# Altium schematic sheet DB_TPM.SchDoc
size Letter
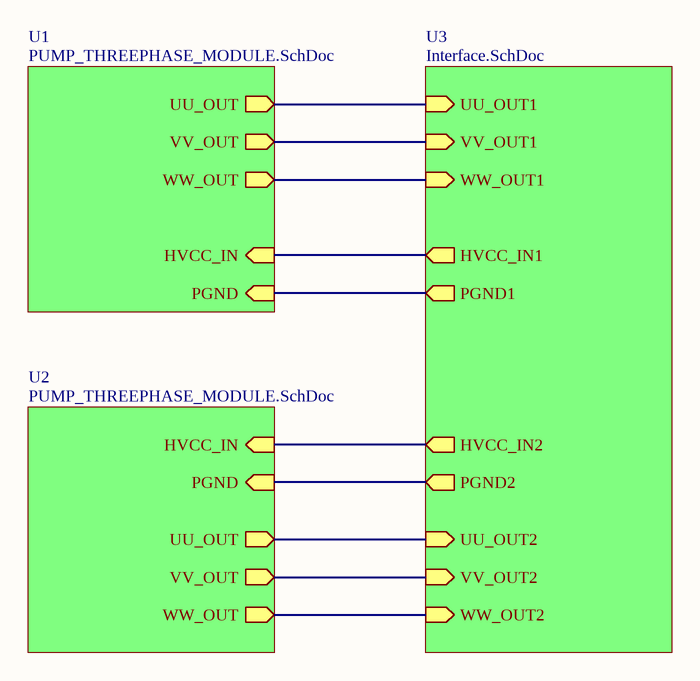
[diagram p0: DB_TPM.SchDoc]

## Sub-sheets
U1 = PUMP_THREEPHASE_MODULE.SchDoc: WW_OUT (out), VV_OUT (out), UU_OUT (out), HVCC_IN (in), PGND (in)
U2 = PUMP_THREEPHASE_MODULE.SchDoc: WW_OUT (out), VV_OUT (out), UU_OUT (out), HVCC_IN (in), PGND (in)
U3 = Interface.SchDoc: HVCC_IN1 (out), PGND1 (out), UU_OUT1 (in), VV_OUT1 (in), WW_OUT1 (in), UU_OUT2 (in), VV_OUT2 (in), WW_OUT2 (in), HVCC_IN2 (out), PGND2 (out)

## Nets
(unnamed): sheet U1/WW_OUT, sheet U3/WW_OUT1
(unnamed): sheet U1/VV_OUT, sheet U3/VV_OUT1
(unnamed): sheet U1/UU_OUT, sheet U3/UU_OUT1
(unnamed): sheet U1/HVCC_IN, sheet U3/HVCC_IN1
(unnamed): sheet U1/PGND, sheet U3/PGND1
(unnamed): sheet U2/WW_OUT, sheet U3/WW_OUT2
(unnamed): sheet U2/VV_OUT, sheet U3/VV_OUT2
(unnamed): sheet U2/UU_OUT, sheet U3/UU_OUT2
(unnamed): sheet U2/HVCC_IN, sheet U3/HVCC_IN2
(unnamed): sheet U2/PGND, sheet U3/PGND2